# EAGLE design Cinemate (EAGLE 9.3.1)
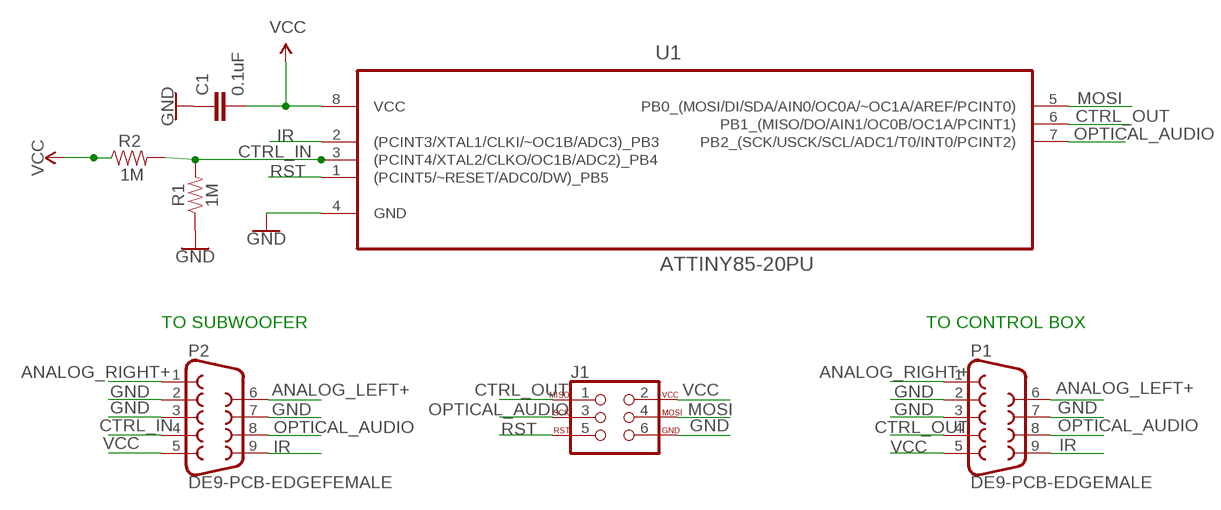
[diagram p0: schematic, sheet 1]

## Parts
C1  0.1uF  0.1UF-KIT-EZ-50V-20%  [CAP-PTH-SMALL-KIT]
J1  AVR_SPI_PROG_3X2PTH  [2X3]
P1  DE9-PCB-EDGEMALE  [DE9-EDGE-M]
P2  DE9-PCB-EDGEFEMALE  [DE9-EDGE-F]
R1  1M  RESISTORAXIAL-0.3  [AXIAL-0.3]
R2  1M  RESISTORAXIAL-0.3  [AXIAL-0.3]
U1  ATTINY85-20PU  [DIP254P762X533-8]

## Nets
ANALOG_LEFT+: P1.6 P2.6
ANALOG_RIGHT+: P1.1 P2.1
CTRL_IN: P2.4 R1.P$2 R2.P$2 U1.3((PCINT4/XTAL2/CLKO/OC1B/ADC2)_PB4)
CTRL_OUT: J1.1 P1.4 U1.6(PB1_(MISO/DO/AIN1/OC0B/OC1A/PCINT1))
GND: C1.1 J1.6 P1.2 P1.3 P1.7 P2.2 P2.3 P2.7 R1.P$1 U1.4(GND)
IR: P1.9 P2.9 U1.2((PCINT3/XTAL1/CLKI/~OC1B/ADC3)_PB3)
MOSI: J1.4 U1.5(PB0_(MOSI/DI/SDA/AIN0/OC0A/~OC1A/AREF/PCINT0))
OPTICAL_AUDIO: J1.3 P1.8 P2.8 U1.7(PB2_(SCK/USCK/SCL/ADC1/T0/INT0/PCINT2))
RST: J1.5 U1.1((PCINT5/~RESET/ADC0/DW)_PB5)
VCC: C1.2 J1.2 P1.5 P2.5 R2.P$1 U1.8(VCC)

## Notes on the sheet
- TO SUBWOOFER | TO CONTROL BOX

## Library data of the parts
C1 = SparkFun-Capacitors:0.1UF: 0.1µF ceramic capacitors A capacitor is a passive two-terminal electrical component used to store electrical energy temporarily in an electric field.; PROD_ID: CAP-08370
J1 = SparkFun-Connectors:AVR_SPI_PROG_3X2: AVR ISP 6 Pin This is the reduced ISP connector for AVR programming. Common on Arduino. This footprint will take up less PCB space and can be used with a 10-pin to 6-pin adapter such as SKU: BOB-08508 **Special note about "TEST_POINT" package. The stop mask is on the top side, so if you want your programming test points to be on the bottom of your board, make sure to place this package on the bottom side of the board. This also ensure that the orientation to program from the bottom side will be correct. SparkFun Products: SparkFun ISP Pogo Adapter <https://www.sparkfun.com/products/11591> - NS Tiny AVR Programmer <https://www.sparkfun.com/products/11801> -PTH
P1 P2 = WackyJay:DE9-PCB-EDGE: DB9 serial connector mounted on the edge of a PCB. Solder cup style connectors work best.
R1 R2 = SparkFun-Resistors:RESISTOR: Generic Resistor Package
U1 = ATTINY85-20PU:ATTINY85-20PU: 8-bit Microcontroller with In-System Programmable Flash; AVAILABILITY: Unavailable; DESCRIPTION: ATtiny Series 20 MHz 8 KB Flash 512 B SRAM 8-Bit Microcontroller - DIP-8; MF: Microchip; MP: ATTINY85-20PU; PACKAGE: DIP-8 Microchip; PRICE: None

## Board
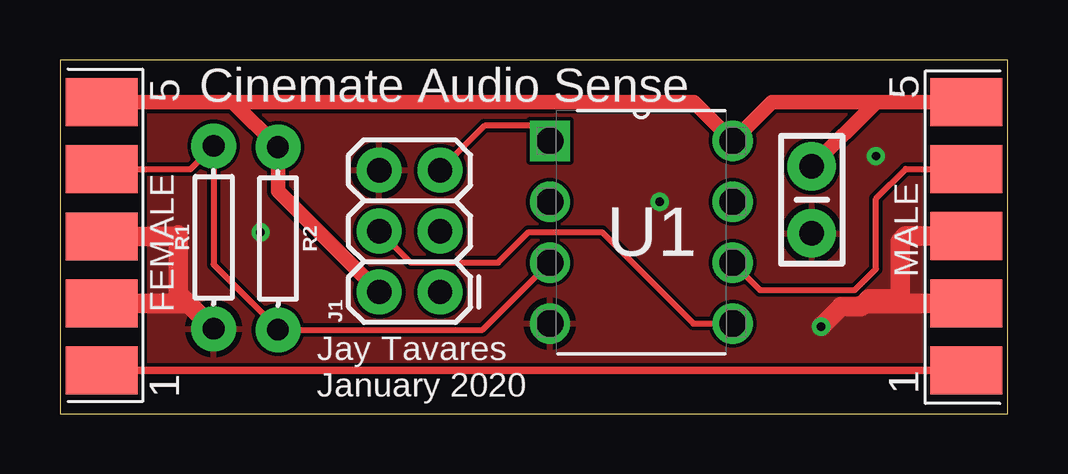
[diagram p1: board, top side]
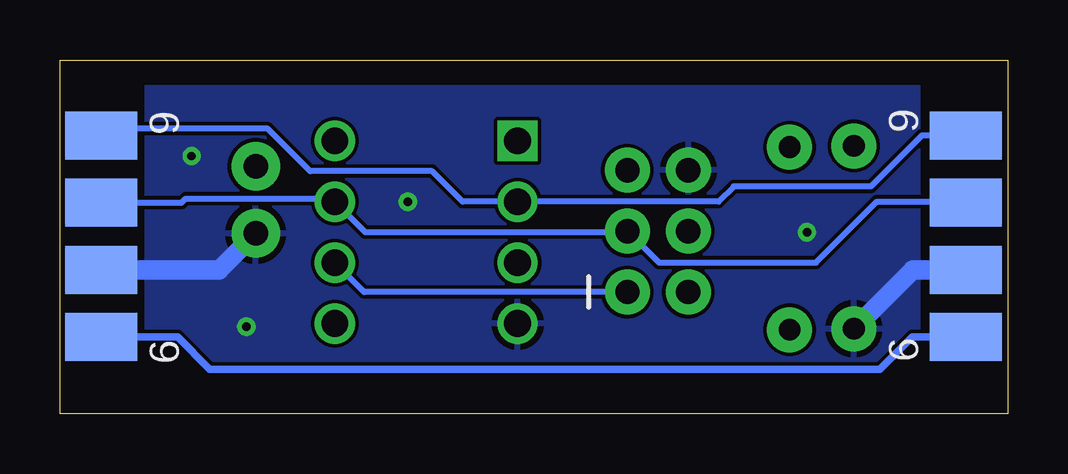
[diagram p2: board, bottom side, seen from below]

Size 39.5 x 14.75 mm. Coordinates in mm from the lower left corner, seen from the top.
Outline: 0,0 39.5,0 39.5,14.75 0,14.75 0,0
Copper layers (1*16): Top 0.035mm / dielectric 1.5mm / Bottom 0.035mm
Design rules "default": minimum track width 6mil, minimum drill 0.35mm, track to track 6mil, track to pad 6mil, pad to pad 6mil, via to via 6mil, smd to smd 6mil, copper to edge 40mil, drill to drill 6mil, minimum pad ring 10mil, minimum via ring 8mil, stop-mask expansion 4mil, vias tented up to drill 0mil, thermal gap 10mil

### Footprints (pad centres in the part's own frame; a part is rotated, then mirrored left to right if it is on the bottom)
CAP-PTH-SMALL-KIT = drill 1.016 pad 2.032: 1 -1.397,0; 2 1.397,0
2X3 = drill 1.016 pad 1.88: 1 0,0; 2 0,2.54; 3 2.54,0; 4 2.54,2.54; 5 5.08,0; 6 5.08,2.54
DE9-EDGE-M = smd 2 x 3: 1 -5.6,0; 2 -2.8,0; 3 0,0; 4 2.8,0; 5 5.6,0 | smd 2 x 3 bottom: 6 -4.2,0; 7 -1.4,0; 8 1.4,0; 9 4.2,0
DE9-EDGE-F = smd 2 x 3: 1 5.6,0; 2 2.8,0; 3 0,0; 4 -2.8,0; 5 -5.6,0 | smd 2 x 3 bottom: 6 4.2,0; 7 1.4,0; 8 -1.4,0; 9 -4.2,0
AXIAL-0.3 = drill 0.9 pad 1.88: P$1 -3.81,0; P$2 3.81,0
DIP254P762X533-8 = drill 1.118 square: 1 -7.62,7.62 | drill 1.118: 2 -7.62,5.08; 3 -7.62,2.54; 4 -7.62,0; 5 0,0; 6 0,2.54; 7 0,5.08; 8 0,7.62

### Placement (x,y rotation side)
C1  31.34,8.92 90 top
J1  15.85,5.07 90 top
P1  37.78,7.4 90 top
P2  1.74,7.39 270 top
R1  6.41,7.35 90 top
R2  9.09,7.3 270 top
U1  28.05,3.75 0 top

### Tracks (layer width: path | path; a pad name or v marks a point on that pad's centre or on a via)
ANALOG_LEFT+
  Bottom 0.305: P2.6 3.97,3.19 5.31,1.85 33.25,1.85 34.6,3.2 P1.6
ANALOG_RIGHT+
  Top 0.305: P2.1 P1.1
CTRL_IN
  Top 0.254: P2.4 5.44,10.19 R1.P$2 6.41,6.22 9.09,3.54 R2.P$2 17.62,3.49 U1.3
CTRL_OUT
  Top 0.254: U1.6 29.19,5.15 33.13,5.15 34.02,6.04 34.02,8.96 35.25,10.2 P1.4
  Bottom 0.254: J1.1 26.82,5.07 U1.6
GND  (via drill 0.35)
  Top 0.813: P2.3 4.89,7.39 4.93,7.44 4.93,5.01 R1.P$1 5.35,4.59 P2.2 | P1.3 35.25,7.4 35.03,7.18 35.03,4.77 33.72,4.77 33.55,4.6 | P1.2 33.55,4.6 | 33.55,4.6 33.41,4.47 32.57,4.47 v31.73,3.63
  Bottom 0.813: P2.7 3.95,5.99 R1.P$1 | P1.7 32.86,6 C1.1
  other vias: 25,8.84 34.02,10.74 8.36,7.57
  pour Top: 3.7,14.7 3.7,0 35.8,0 35.9,-0.1 35.9,14.6 36,14.7
  pour Bottom: 3.7,14.7 3.7,0.1 3.8,0 35.9,0 35.9,14.6 35.8,14.7
IR
  Bottom 0.254: P2.9 3.57,11.59 5.7,9.47 11.41,9.47 12.05,8.83 U1.2 22.71,8.83 23.98,10.11 29.06,10.11 30.84,11.88 37.5,11.88 P1.9
MOSI
  Top 0.254: J1.4 14.62,6.29 18.27,6.29 19.54,7.57 22.59,7.57 26.4,3.75 U1.5
OPTICAL_AUDIO
  Bottom 0.254: P1.8 34.43,8.8 34.27,8.96 28.17,8.96 U1.7 26.78,7.57 15.89,7.57 J1.3 14.53,6.29 7.98,6.29 5.44,8.84 1.78,8.84 P2.8
RST
  Top 0.254: U1.1 19.79,12.01 17.7,12.01 J1.5
VCC
  Top 0.61: P2.5 7.21,12.99 | 7.21,12.99 26.43,12.99 U1.8 29.67,13 P1.5 34.02,13 C1.2 | J1.2 9.09,9.29 R2.P$1 7.21,12.99

### Text on the board
tPlace: Cinemate Audio Sense | Jay Tavares / January 2020